# Altium schematic sheet MSP430.SchDoc
size A4
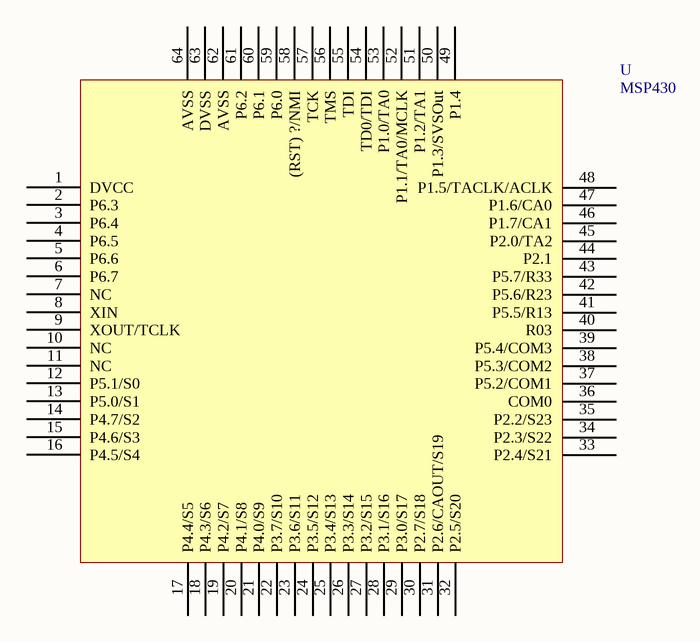
[diagram p0: MSP430.SchDoc]

## Parts
U  MSP430

## Nets

Not connected (* = marked no-connect by the designer): U 1(DVCC) 2(P6.3) 3(P6.4) 4(P6.5) 5(P6.6) 6(P6.7) 7(NC) 8(XIN) 9(XOUT/TCLK) 10(NC) 11(NC) 12(P5.1/S0) 13(P5.0/S1) 14(P4.7/S2) 15(P4.6/S3) 16(P4.5/S4) 17(P4.4/S5) 18(P4.3/S6) 19(P4.2/S7) 20(P4.1/S8) 21(P4.0/S9) 22(P3.7/S10) 23(P3.6/S11) 24(P3.5/S12) 25(P3.4/S13) 26(P3.3/S14) 27(P3.2/S15) 28(P3.1/S16) 29(P3.0/S17) 30(P2.7/S18) 31(P2.6/CAOUT/S19) 32(P2.5/S20) 33(P2.4/S21) 34(P2.3/S22) 35(P2.2/S23) 36(COM0) 37(P5.2/COM1) 38(P5.3/COM2) 39(P5.4/COM3) 40(R03) 41(P5.5/R13) 42(P5.6/R23) 43(P5.7/R33) 44(P2.1) 45(P2.0/TA2) 46(P1.7/CA1) 47(P1.6/CA0) 48(P1.5/TACLK/ACLK) 49(P1.4) 50(P1.3/SVSOut) 51(P1.2/TA1) 52(P1.1/TA0/MCLK) 53(P1.0/TA0) 54(TD0/TDI) 55(TDI) 56(TMS) 57(TCK) 58((RST)_?/NMI) 59(P6.0) 60(P6.1) 61(P6.2) 62(AVSS) 63(DVSS) 64(AVSS)